# Altium schematic sheet external_connector.SchDoc
size A4
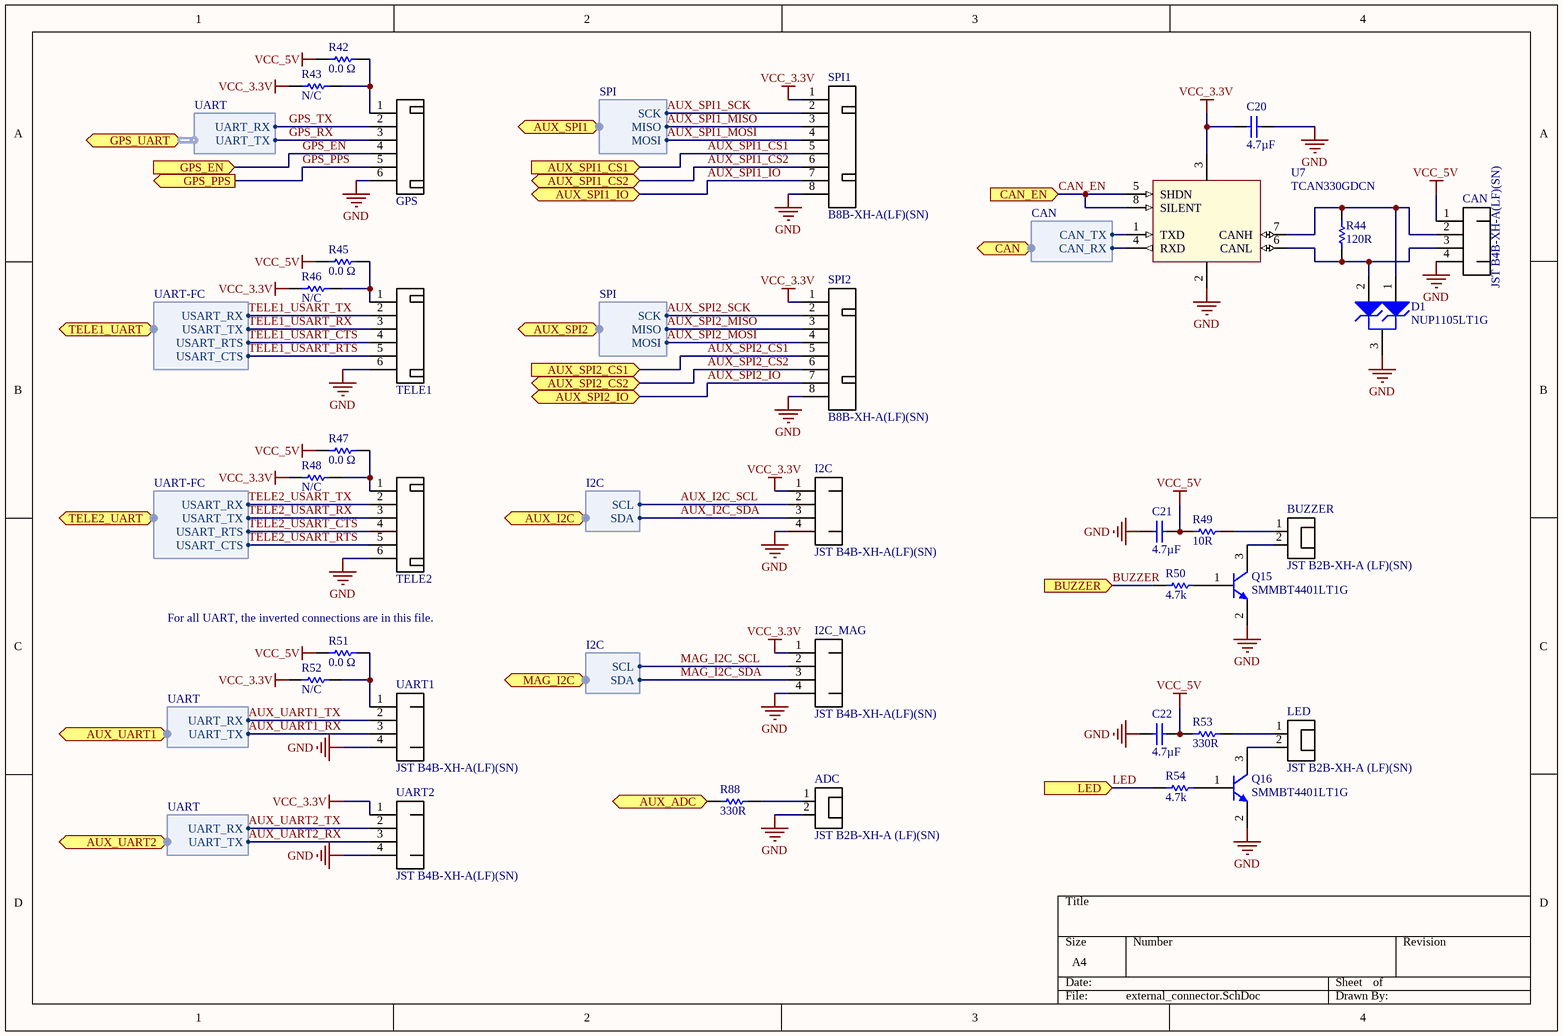
[diagram p0: external_connector.SchDoc]

## Parts
ADC  JST B2B-XH-A (LF)(SN)  [PCB-s8s8ac3ylnu6waak0fxh-1]
BUZZER  JST B2B-XH-A (LF)(SN)  [PCB-s8s8ac3ylnu6waak0fxh-1]
C20  4.7µF  [CAPC1608X90X35NL15T15]
C21  4.7µF  [CAPC1608X90X35NL15T15]
C22  4.7µF  [CAPC1608X90X35NL15T15]
CAN  JST B4B-XH-A(LF)(SN)  [PCB-nwmfqt4y1xdboio0wsyw-1]
D1  NUP1105LT1G  [ONSC-SOT-23-3-318-08_V]
GPS  JST B6B-XH-A(LF)(SN)  [PCB-z7tho54h7p2kc79zj16v-1]  (value not drawn)
I2C  JST B4B-XH-A(LF)(SN)  [PCB-nwmfqt4y1xdboio0wsyw-1]
I2C_MAG  JST B4B-XH-A(LF)(SN)  [PCB-nwmfqt4y1xdboio0wsyw-1]
LED  JST B2B-XH-A (LF)(SN)  [PCB-s8s8ac3ylnu6waak0fxh-1]
Q15  SMMBT4401LT1G  [ONSC-SOT-23-3-318-08_V]
Q16  SMMBT4401LT1G  [ONSC-SOT-23-3-318-08_V]
R42  0.0 Ω  [RESC1608X55X25LL10T15]
R43  N/C  [RESC1608X55X25LL10T15]
R44  120R  [PCB-9ibrwdurth7ekdzjdzvn-1]
R45  0.0 Ω  [RESC1608X55X25LL10T15]
R46  N/C  [RESC1608X55X25LL10T15]
R47  0.0 Ω  [RESC1608X55X25LL10T15]
R48  N/C  [RESC1608X55X25LL10T15]
R49  10R  [RESC1608X06N]
R50  4.7k  [RESC1609X55X30NL10T20]
R51  0.0 Ω  [RESC1608X55X25LL10T15]
R52  N/C  [RESC1608X55X25LL10T15]
R53  330R  [PCB-gqq469mmsoijq124jywu-1]
R54  4.7k  [RESC1609X55X30NL10T20]
R88  330R  [PCB-gqq469mmsoijq124jywu-1]
SPI1  Manufacturer Part Number: B8B-XH-A(LF)(SN)  [PCB-mlv55ck369se549tp0uo-1]  (hidden comment: JST B8B-XH-A(LF)(SN))
SPI2  Manufacturer Part Number: B8B-XH-A(LF)(SN)  [PCB-mlv55ck369se549tp0uo-1]  (hidden comment: JST B8B-XH-A(LF)(SN))
TELE1  JST B6B-XH-A(LF)(SN)  [PCB-z7tho54h7p2kc79zj16v-1]  (value not drawn)
TELE2  JST B6B-XH-A(LF)(SN)  [PCB-z7tho54h7p2kc79zj16v-1]  (value not drawn)
U7  TCAN330GDCN  [PCB-dudqu7qvc0a2juw3nqi5-1]
UART1  JST B4B-XH-A(LF)(SN)  [PCB-nwmfqt4y1xdboio0wsyw-1]
UART2  JST B4B-XH-A(LF)(SN)  [PCB-nwmfqt4y1xdboio0wsyw-1]

## Ports
AUX_ADC (out), AUX_I2C (harness I2C), AUX_SPI1 (harness SPI), AUX_SPI1_CS1 (in), AUX_SPI1_CS2 (bidir), AUX_SPI1_IO (bidir), AUX_SPI2 (harness SPI), AUX_SPI2_CS1 (in), AUX_SPI2_CS2 (bidir), AUX_SPI2_IO (bidir), AUX_UART1 (harness UART), AUX_UART2 (harness UART), BUZZER (in), CAN (harness CAN), CAN_EN (in), GPS_EN (in), GPS_PPS (out), GPS_UART (harness UART), LED (in), MAG_I2C (harness I2C), TELE1_UART (harness UART-FC), TELE2_UART (harness UART-FC)

## Harnesses
I2C: SCL, SDA
UART: UART_TX, UART_RX
UART-FC: USART_TX, USART_RX, USART_CTS, USART_RTS
SPI: MOSI, MISO, SCK
CAN: CAN_TX, CAN_RX

## Nets
GND: ADC.2 C20.2 C21.1 C22.1 CAN.4 D1.3(K) GPS.6 I2C.4 I2C_MAG.4 Q15.2(E) Q16.2(E) SPI1.8 SPI2.8 TELE1.6 TELE2.6 U7.2(GND) UART1.4 UART2.4
VCC_3.3V: C20.1 I2C.1 I2C_MAG.1 R43.2 R46.2 R48.2 R52.2 SPI1.1 SPI2.1 U7.3(VCC) UART2.1
VCC_5V: C21.2 C22.2 CAN.1 R42.2 R45.2 R47.2 R49.1 R51.2 R53.1
AUX_ADC: R88.1 ; port AUX_ADC
AUX_I2C_SCL: I2C.2 ; port AUX_I2C.SCL
AUX_I2C_SDA: I2C.3 ; port AUX_I2C.SDA
AUX_SPI1_CS1: SPI1.5 ; port AUX_SPI1_CS1
AUX_SPI1_CS2: SPI1.6 ; port AUX_SPI1_CS2
AUX_SPI1_IO: SPI1.7 ; port AUX_SPI1_IO
AUX_SPI1_MISO: SPI1.3 ; port AUX_SPI1.MISO
AUX_SPI1_MOSI: SPI1.4 ; port AUX_SPI1.MOSI
AUX_SPI1_SCK: SPI1.2 ; port AUX_SPI1.SCK
AUX_SPI2_CS1: SPI2.5 ; port AUX_SPI2_CS1
AUX_SPI2_CS2: SPI2.6 ; port AUX_SPI2_CS2
AUX_SPI2_IO: SPI2.7 ; port AUX_SPI2_IO
AUX_SPI2_MISO: SPI2.3 ; port AUX_SPI2.MISO
AUX_SPI2_MOSI: SPI2.4 ; port AUX_SPI2.MOSI
AUX_SPI2_SCK: SPI2.2 ; port AUX_SPI2.SCK
AUX_UART1_RX: UART1.3 ; port AUX_UART1.UART_TX
AUX_UART1_TX: UART1.2 ; port AUX_UART1.UART_RX
AUX_UART2_RX: UART2.3 ; port AUX_UART2.UART_TX
AUX_UART2_TX: UART2.2 ; port AUX_UART2.UART_RX
BUZZER: R50.1 ; port BUZZER
CAN_EN: U7.5(SHDN) U7.8(SILENT) ; port CAN_EN
GPS_EN: GPS.4 ; port GPS_EN
GPS_PPS: GPS.5 ; port GPS_PPS
GPS_RX: GPS.3 ; port GPS_UART.UART_TX
GPS_TX: GPS.2 ; port GPS_UART.UART_RX
LED: R54.1 ; port LED
MAG_I2C_SCL: I2C_MAG.2 ; port MAG_I2C.SCL
MAG_I2C_SDA: I2C_MAG.3 ; port MAG_I2C.SDA
TELE1_USART_CTS: TELE1.4 ; port TELE1_UART.USART_RTS
TELE1_USART_RTS: TELE1.5 ; port TELE1_UART.USART_CTS
TELE1_USART_RX: TELE1.3 ; port TELE1_UART.USART_TX
TELE1_USART_TX: TELE1.2 ; port TELE1_UART.USART_RX
TELE2_USART_CTS: TELE2.4 ; port TELE2_UART.USART_RTS
TELE2_USART_RTS: TELE2.5 ; port TELE2_UART.USART_CTS
TELE2_USART_RX: TELE2.3 ; port TELE2_UART.USART_TX
TELE2_USART_TX: TELE2.2 ; port TELE2_UART.USART_RX
NetADC_1: ADC.1 R88.2
NetBUZZER_1: BUZZER.1 R49.2
NetBUZZER_2: BUZZER.2 Q15.3(C)
NetCAN_2: CAN.2 D1.1(A1) R44.2 U7.7(CANH)
NetCAN_3: CAN.3 D1.2(A2) R44.1 U7.6(CANL)
NetGPS_1: GPS.1 R42.1 R43.1
NetLED_1: LED.1 R53.2
NetLED_2: LED.2 Q16.3(C)
NetQ15_1: Q15.1(B) R50.2
NetQ16_1: Q16.1(B) R54.2
NetR45_1: R45.1 R46.1 TELE1.1
NetR47_1: R47.1 R48.1 TELE2.1
NetR51_1: R51.1 R52.1 UART1.1
NetU7_1: U7.1(TXD) ; port CAN.CAN_TX
NetU7_4: U7.4(RXD) ; port CAN.CAN_RX

## Notes on the sheet
- (near R51) For all UART, the inverted connections are in this file.

## Library data of the parts
ADC BUZZER LED = CMP-a2a66bdac84f7d61-16: XH Series 2 Position 2.5 mm Pitch Through Hole Top Entry Shrouded Header; Gender: Male; Voltage Rating (AC): 250 V; Lead-Free Status: Lead Free; Insulation Resistance: 1.00 GΩ; Number of Contacts: 2; Contact Resistance: 10.0 mΩ; Current Rating: 3.00 A; Mounting Style: Through Hole, Vertical; RoHS: Compliant; Manufacturer Part Number: B2B-XH-A (LF)(SN); Octopart URL: http://octopart.com/b2b-xh-a+%28lf%29%28sn%29-jst-7753615; Contact Material: Brass; REACH SVHC Compliance: No SVHC; OctopartID: a2a66bdac84f7d61; Contact Plating: Tin
C20-C22 = CMP-147010-6: 0603 4.7 uF 10 V ±10 % Tolerance X5R SMT Multilayer Ceramic Capacitor; Voltage Rating (DC): 10.0 V; Capacitance Tolerance: ±10%; Lead-Free Status: Lead Free; Capacitance: 4.70 µF; Operating Temperature: -55.0 °C to 85.0 °C; Dielectric Characteristic: X5R; OctopartID: 876b4eec68d658ac; Octopart URL: https://octopart.com/cc0603krx5r6bb475-yageo-9292507; Number of Pins: 2; Mounting Style: Surface Mount; RoHS: Compliant
CAN I2C I2C_MAG UART1 UART2 = CMP-2acae3fced1af50d-8: XH Series 4 Position 2.5 mm Pitch Through Hole Crimp Top Entry Shrouded Header; Manufacturer: JST; Manufacturer Part Number: JST B4B-XH-A(LF)(SN)
D1 = CMP-296179-2: Single Line CAN / LIN Bus Protector, 3-Pin SOT-23, Pb-Free, Tape and Reel; Breakdown Voltage: 28.4 V; Lead-Free Status: Lead Free; Case/Package: SOT-23-3; Halogen Free Status: Halogen Free; Lifecycle Status: Active; Number of Pins: 3; Octopart Url: https://octopart.com/nup1105lt1g-on+semiconductor-1412616; OctopartID: 54649d7bff0a8ba3; Packaging: Cut Tape (CT); RoHS: Compliant; Manufacturer Part Number: NUP1105LT1G
GPS TELE1 TELE2 = CMP-f3cb3ac5a78f2c0c-10: Socket; wire-board; male; XH; 2.5mm; PIN: 6; THT; 250V; 3A; -25÷85°C; Number of Contacts: 6; Lead-Free Status: Contains Lead; Manufacturer Part Number: B6B-XH-A
Q15 Q16 = CMP-860861-2: Switching Transistor, NPN Silicon, 3-Pin SOT-23, Pb-Free, Tape and Reel; Lead-Free Status: Lead Free; Lifecycle Status: Active; Octopart Url: https://octopart.com/smmbt4401lt1g-on+semiconductor-17512939; OctopartID: 7accb2cd6641a50b; RoHS: Compliant; Manufacturer Part Number: SMMBT4401LT1G
R42 R45 R47 R51 = CMP-3661350-4: Thick Film Resistors - SMD ZERO OHM JUMPER; Voltage Rating (DC): 50.0 V; Lead-Free Status: Lead Free; Resistance Tolerance: ±5%; Octopart Url: https://octopart.com/rc0603jr-130rl-yageo-9297262; Case/Package: 0603; OctopartID: ee3b27bc163331fc; Resistance: 0.0 Ω
R43 R46 R48 R52 = CMP-3661350-4: Thick Film Resistors - SMD ZERO OHM JUMPER; Voltage Rating (DC): 50.0 V; Lead-Free Status: Lead Free; Resistance Tolerance: ±5%; Resistance: 0.0 Ω; Octopart Url: https://octopart.com/rc0603jr-130rl-yageo-9297262; Case/Package: 0603; OctopartID: ee3b27bc163331fc
R44 = CMP-86e64d9c460d5921-7: Res Thick Film 0805 120 Ohm 1% 0.125W(1/8W) ±100ppm/C Pad SMD T/R; Voltage Rating (DC): 150 V; Lead-Free Status: Lead Free; Temperature Coefficient: -100 ppm/°C to 100 ppm/°C; Power Rating: 125 mW; Number of Pins: 2; OctopartID: 86e64d9c460d5921; Resistance Tolerance: ±1%; Size-Length: 2.00 mm; Size-Height: 500 µm; RoHS: Compliant; Case/Package: 0805; REACH SVHC Compliance: No SVHC
R49 = CMP-3652131-6: Precision resistor, SMD [Panasonic Automotive & Industrial Systems] ERJ3EKF10R0V Precision resistor, SMD; Manufacturer Part Number: ERJ-3EKF10R0V; Resistance Tolerance: ±1%; Lead-Free Status: Lead Free; Case/Package (SI): 1608; Power Rating: 100 mW; Voltage Rating (DC): 75.0 V; Mounting Style: Surface Mount; Size-Height: 450 µm; Lifecycle Status: Not Listed by Manufacturer; OctopartID: 4370893702979cb7; Size-Width: 800 µm; Number of Pins: 2; RoHS: Compliant; Case/Package: 0603; Size-Length: 1.60 mm; Octopart URL: http://octopart.com/erj-3ekf10r0v-panasonic-55403649; Packaging: Tape & Reel (TR), Cut Tape (CT)
R50 R54 = CMP-1863095-2: RES SMD 4.7K OHM 0.1% 1/10W 0603; Manufacturer Part Number: TNPW06034K70BEEA; Lead-Free Status: Lead Free; Power Rating: 0.1 W; Resistance: 4700.0 Ω; Voltage Rating (DC): 75.0 V; Case/Package: 0603; Number of Pins: 2; Octopart Url: https://octopart.com/tnpw06034k70beea-vishay+dale-42338354; OctopartID: 172ddca13a79c8ea; Packaging: Cut Tape (CT); Resistance Tolerance: ±0.1%; RoHS: Compliant
R53 R88 = CMP-1852941-7: Res General Purpose Thick Film 0603 330 Ohm 5% 1/10W ±100ppm/°C Molded SMD Paper T/R; Manufacturer Part Number: RC0603JR-07330RL; Case/Package (SI): 1608; Temperature Coefficient: -100 ppm/°C to 100 ppm/°C; Resistance: 330 Ω; Power Rating: 100 mW; Octopart URL: https://octopart.com/rc0603jr-07330rl-yageo-39803615; Size-Height: 450 µm; RoHS: Compliant; Resistance Tolerance: ±5%; Packaging: Tape & Reel; Number of Pins: 2; Mounting Style: Surface Mount; Operating Temperature: 155 °C (max); Size-Width: 800 µm; OctopartID: 0b82c0d7743bd445; Case/Package: 0603
SPI1 SPI2 = CMP-8c2545134b9253e2-2: Connector Header, XH Series, 8 Position, 2.50mm, Through Hole, Press-Fit, Solder, Natural; Manufacturer: JST Sales America Inc.; VALUE: 8P VERT; Insulation Resistance: 1.00 G?; Voltage Rating (AC): 250 V; Gender: Male; Lead-Free Status: Lead Free; Current Rating: 3.00 A; Number of Contacts: 8; Contact Resistance: 10.0 m?; OctopartID: 8c2545134b9253e2; Mounting Style: Through Hole, Vertical; Octopart URL: https://octopart.com/b8b-xh-a%28lf%29%28sn%29-jst-3990225; Contact Plating: Tin, Tin Lead; Operating Temperature: -25.0 °C (min); RoHS: Compliant; REACH SVHC Compliance: No SVHC; Contact Material: Brass
U7 = CMP-a47f694d5ac37bb8-2: 3.3-V CAN Transceivers with CAN FD (Flexible Data Rate) 8-SOT-23 -40 to 125; Manufacturer Part Number: TCAN330GDCNR; Lead-Free Status: Contains Lead; Lifecycle Status: Pre-Release; Operating Temperature: -40.0 °C to 125 °C; Number of Pins: 8; RoHS: Compliant; Case/Package: SOT-23; Octopart URL: https://octopart.com/tcan330gdcnr-texas+instruments-70835162; OctopartID: a47f694d5ac37bb8